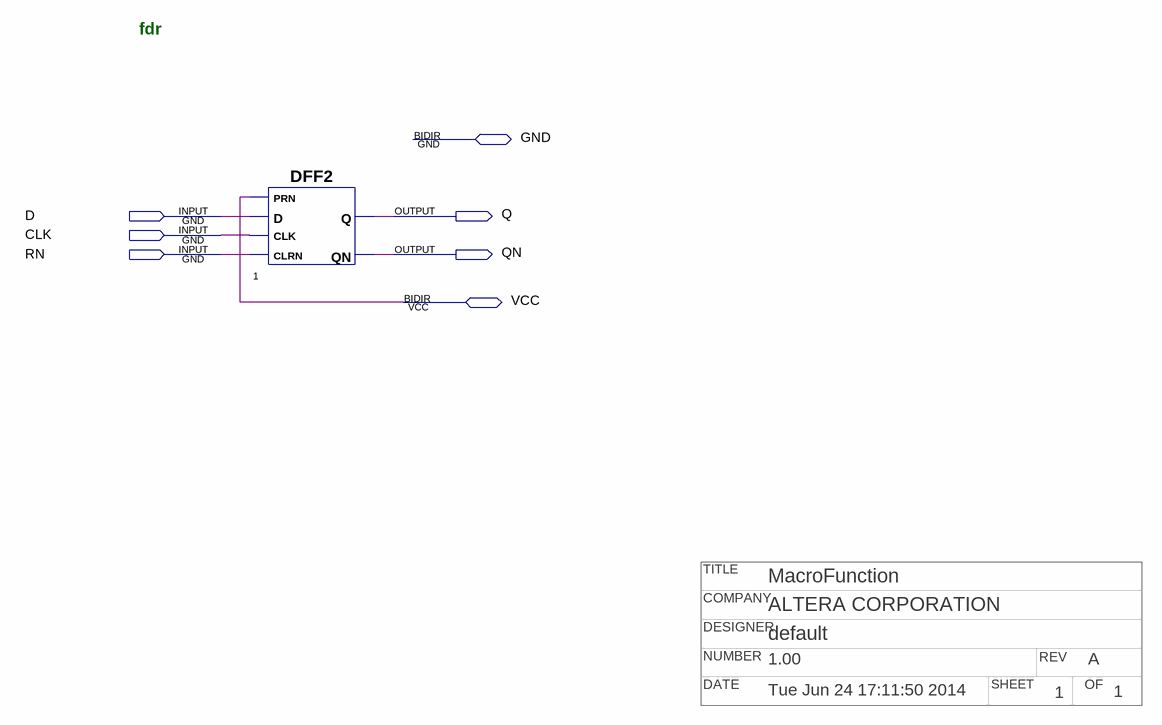
[diagram p0: schematic sheet]
// Quartus schematic npfdr.bdf as structural Verilog: 1 symbols, 7 pins
// Title block: TITLE: MacroFunction; COMPANY: ALTERA CORPORATION; DESIGNER: default; NUMBER: 1.00; REV: A; DATE: Tue Jun 24 17:11:50 2014; SHEET: 1; OF: 1
module npfdr (
  input  D,
  input  CLK,
  input  RN,
  inout  GND,
  inout  VCC,
  output Q,
  output QN
);

  DFF2 u_1 (.CLK(CLK), .D(D), .PRN(VCC), .CLRN(RN), .Q(Q), .QN(QN));

  // Notes on the sheet:
  //   fdr
endmodule
